# Altium schematic sheet WIFIBT_AP6398S.SchDoc
size A3; SheetNumber: 17; SheetTotal: 22
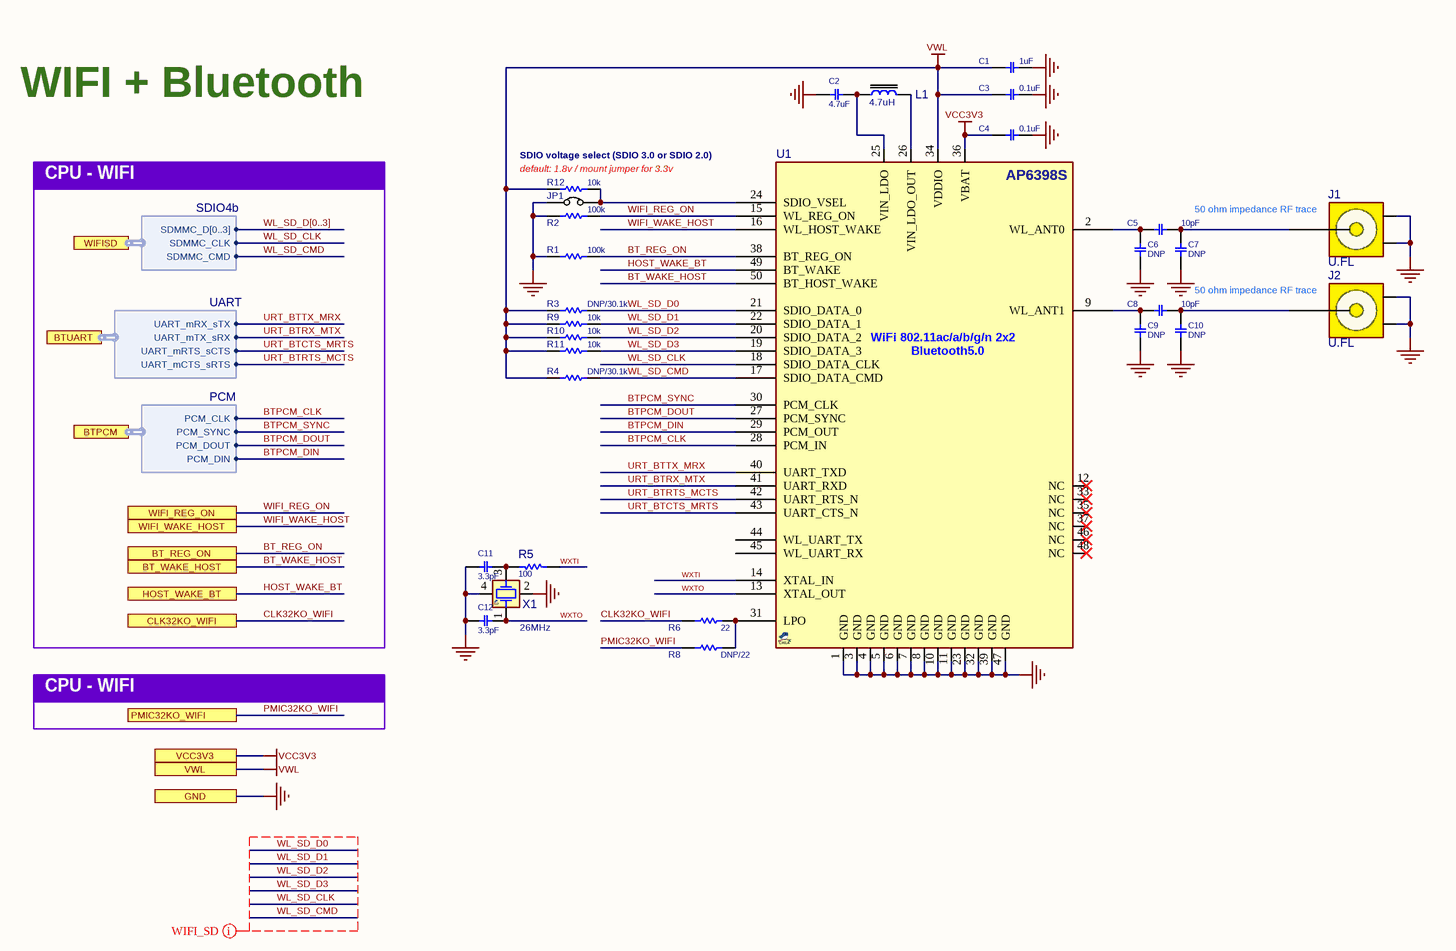
[diagram p0: WIFIBT_AP6398S.SchDoc]

## Parts
C1  1uF  [C0402]
C2  4.7uF  [C0402]
C3  0.1uF  [C0402]
C4  0.1uF  [C0402]
C5  10pF  [C0402]
C6  DNP  [C0402]
C7  DNP  [C0402]
C8  10pF  [C0402]
C9  DNP  [C0402]
C10  DNP  [C0402]
C11  3.3pF  [C0402]
C12  3.3pF  [C0402]
J1  U.FL  [UFL]
J2  U.FL  [UFL]
JP1  JMPSOLDER  [JP_60X100]  (value not drawn)
L1  4.7uH  [L_3]
R1  100k  [R0402]
R2  100k  [R0402]
R3  DNP/30.1k  [R0402]
R4  DNP/30.1k  [R0402]
R5  100  [R0402]
R6  22  [R0402]
R8  DNP/22  [R0402]
R9  10k  [R0402]
R10  10k  [R0402]
R11  10k  [R0402]
R12  10k  [R0402]
U1  AP6398S  [AP6398S_50]  (value not drawn)
X1  26MHz  [XTL_4_2016]

## Ports
BT_REG_ON, BT_WAKE_HOST, BTPCM (harness PCM), BTUART (harness UART), CLK32KO_WIFI, GND, HOST_WAKE_BT, PMIC32KO_WIFI, VCC3V3, VWL, WIFI_REG_ON, WIFI_WAKE_HOST, WIFISD (harness SDIO4b)

## Harnesses
SDIO4b: SDMMC_CMD, SDMMC_D[0..3], SDMMC_CLK
UART: UART_mRX_sTX, UART_mTX_sRX, UART_mRTS_sCTS, UART_mCTS_sRTS
PCM: PCM_CLK, PCM_SYNC, PCM_DOUT, PCM_DIN

## Nets
GND: C1.1 C2.2 C3.1 C4.1 C6.2 C7.2 C9.2 C10.2 C11.2 C12.2 J1.2(G1) J1.3(G2) J2.2(G1) J2.3(G2) JP1.1 R1.2 R2.2 U1.1(GND) U1.3(GND) U1.4(GND) U1.5(GND) U1.6(GND) U1.7(GND) U1.8(GND) U1.10(GND) U1.11(GND) U1.23(GND) U1.32(GND) U1.39(GND) U1.47(GND) X1.2(GND1) X1.4(GND2) ; port GND
VCC3V3: C4.2 U1.36(VBAT) ; port VCC3V3
VWL: C1.2 C3.2 R3.2 R4.2 R9.2 R10.2 R11.2 R12.2 U1.34(VDDIO) ; port VWL
BT_REG_ON: R1.1 U1.38(BT_REG_ON) ; port BT_REG_ON
BT_WAKE_HOST: U1.50(BT_HOST_WAKE) ; port BT_WAKE_HOST
BTPCM_CLK: U1.28(PCM_IN) ; port BTPCM.PCM_CLK
BTPCM_DIN: U1.29(PCM_OUT) ; port BTPCM.PCM_DIN
BTPCM_DOUT: U1.27(PCM_SYNC) ; port BTPCM.PCM_DOUT
BTPCM_SYNC: U1.30(PCM_CLK) ; port BTPCM.PCM_SYNC
CLK32KO_WIFI: R6.2 ; port CLK32KO_WIFI
HOST_WAKE_BT: U1.49(BT_WAKE) ; port HOST_WAKE_BT
PMIC32KO_WIFI: R8.2 ; port PMIC32KO_WIFI
URT_BTCTS_MRTS: U1.43(UART_CTS_N) ; port BTUART.UART_mRTS_sCTS
URT_BTRTS_MCTS: U1.42(UART_RTS_N) ; port BTUART.UART_mCTS_sRTS
URT_BTRX_MTX: U1.41(UART_RXD) ; port BTUART.UART_mTX_sRX
URT_BTTX_MRX: U1.40(UART_TXD) ; port BTUART.UART_mRX_sTX
WIFI_REG_ON: R2.1 U1.15(WL_REG_ON) ; port WIFI_REG_ON
WIFI_WAKE_HOST: U1.16(WL_HOST_WAKE) ; port WIFI_WAKE_HOST
WL_SD_CLK: U1.18(SDIO_DATA_CLK) ; port WIFISD.SDMMC_CLK
WL_SD_CMD: R4.1 U1.17(SDIO_DATA_CMD) ; port WIFISD.SDMMC_CMD
WL_SD_D0: R3.1 U1.21(SDIO_DATA_0)
WL_SD_D1: R9.1 U1.22(SDIO_DATA_1)
WL_SD_D2: R10.1 U1.20(SDIO_DATA_2)
WL_SD_D3: R11.1 U1.19(SDIO_DATA_3)
WXTI: R5.2 U1.14(XTAL_IN)
WXTO: C12.1 U1.13(XTAL_OUT) X1.1(XA)
NetC2_1: C2.1 L1.1 U1.25(VIN_LDO)
NetC5_1: C5.1 C7.1 J1.1(SIG)
NetC5_2: C5.2 C6.1 U1.2(WL_ANT0)
NetC8_1: C8.1 C10.1 J2.1(SIG)
NetC8_2: C8.2 C9.1 U1.9(WL_ANT1)
NetC11_1: C11.1 R5.1 X1.3(XB)
NetJP1_2: JP1.2 R12.1 U1.24(SDIO_VSEL)
NetL1_2: L1.2 U1.26(VIN_LDO_OUT)
NetR6_1: R6.1 R8.1 U1.31(LPO)

Not connected (* = marked no-connect by the designer): U1 12(NC)* 33(NC)* 35(NC)* 37(NC)* 44(WL_UART_TX) 45(WL_UART_RX) 46(NC)* 48(NC)*

## Buses and harness runs
bus WL_SD_D[0..3]

## Layout directives
net class WIFI_SD: WL_SD_CLK, WL_SD_CMD, WL_SD_D0, WL_SD_D1, WL_SD_D2, WL_SD_D3

## Notes on the sheet
- WIFI + Bluetooth
- CPU - WIFI
- SDIO voltage select (SDIO 3.0 or SDIO 2.0)
- (near R12) default: 1.8v / mount jumper for 3.3v
- (near J1) 50 ohm impedance RF trace
- (near J2) 50 ohm impedance RF trace
- (in symbol AP6398S) WiFi 802.11ac/a/b/g/n 2x2; Bluetooth5.0

## Library data of the parts
C1 = CAP_SMD_MLCC: CAP, MLCC; PARAM: X5R, 10%; MANF_P#: CL05A105KO5NNND; MANF: Samsung; PARAM2: 16v; PRICE: 50,000:	$0.006; ASSEMBLY: ASSEMBLY; VALUE: 1uF
C2 = CAP_SMD_MLCC: CAP, MLCC; PARAM: X5R, 20%; MANF_P#: LMK105BBJ475MVLF; MANF: Taiyo Yuden; PARAM2: 10v; PRICE: 10,000: $0.034; ASSEMBLY: ASSEMBLY; VALUE: 4.7uF
C3 C4 = CAP_SMD_MLCC: CAP, MLCC; PARAM: X5R, 10%; MANF_P#: GRM155R61E104; MANF: Murata; PARAM2: 25v; PRICE: 10,000:$0.006; ASSEMBLY: ASSEMBLY; VALUE: 0.1uF
C5 C8 = CAP_SMD_MLCC: CAP, MLCC; PARAM: C0G, 10%; DESC: CAP, MLCC, 1nF, 50V, C0G, 10%, 0402; MANF_P#: CC0402JRNPO9BN100; MANF: YAGEO; PARAM2: 50V; PRICE: 100= $0.012; ASSEMBLY: ASSEMBLY; VALUE: 10pF
C6 C7 C9 C10 = CAP_SMD_MLCC: CAP, MLCC, 1nF, 50V, C0G, 10%, 0402; PARAM: C0G, 10%; PRICE: 100= 1$; DESC: CAP, MLCC, 1nF, 50V, C0G, 10%, 0402; MANF_P#: -; MANF: -; PARAM2: 50V; ASSEMBLY: ASSEMBLY; VALUE: DNP
C11 C12 = CAP_SMD_MLCC: CAP, MLCC; PARAM: C0G, 10%; MANF_P#: CC0402CRNPO9BN3R3; MANF: Yageo; PARAM2: 50V; PRICE: 100: 0.009$; DESC: CAP, MLCC; ASSEMBLY: ASSEMBLY; VALUE: 3.3pF
J1 J2 = CONN_RF_UFL: CONN, RF, U.FL, STRAIGHT, Ultra Miniature Coaxial; MANF_P#: CONUFL001-SMD, U.FL-R-SMT-1(10), 128-0711-201; MANF: Linx, Hirose, Cinch; PARAM: 50Ohm, 6GHz; DESC: DESCRIPTION; DIST#: DIGIKEY, MOUSER; PARAM2: GOLD; ASSEMBLY: ASSEMBLY; PRICE: 0.9$; VALUE: U.FL
JP1 = JUMPER_SOLDER: JUMPER, HEADER 2PIN; MANF: MANF; MANF_P#: MANF_P#; VALUE: JMPSOLDER
L1 = INDPWR_SMD: INDUCTOR, POWER, SMD; MANF: Bourns; MANF_P#: SRN3010-4R7M; PARAM2: 20%, 150mOhm; PARAM: 1A; VALUE: 4.7uH
R1-R6 R8-R12 = RES_SMD: RESISTOR, SMD; PARAM: 0.063W; DESC: DESCRIPTION; DIST#: MOUSER; PARAM2: 1%; MANF_P#: -; MANF: -; ASSEMBLY: ASSEMBLY; PRICE: 100= 0.3$
  R1 R2: VALUE: 100k
  R3 R4: VALUE: DNP/30.1k
  R5: VALUE: 100
  R6: VALUE: 22
  R8: VALUE: DNP/22
  R9-R12: VALUE: 10k
U1 = AP6398S: WiFi with Bluetooth 5.0,; MANF: AMPAK; PARAM2: 3.2~3.8V; PARAM: IEEE 802.11ac/a/b/g/n 2x2; MANF_P#: AP6398S; VALUE: AP6398S
X1 = XTL_4_40MHz_3225F: CRYSTAL; MANF: Murata; PARAM: 20PPM, -30~85oC; PARAM2: 6pF, 150OhmESR; MANF_P#: XRCGB26M000F2P00R0; ASSEMBLY: ASSEMBLY; PRICE: 1,000: $0.2; VALUE: 26MHz